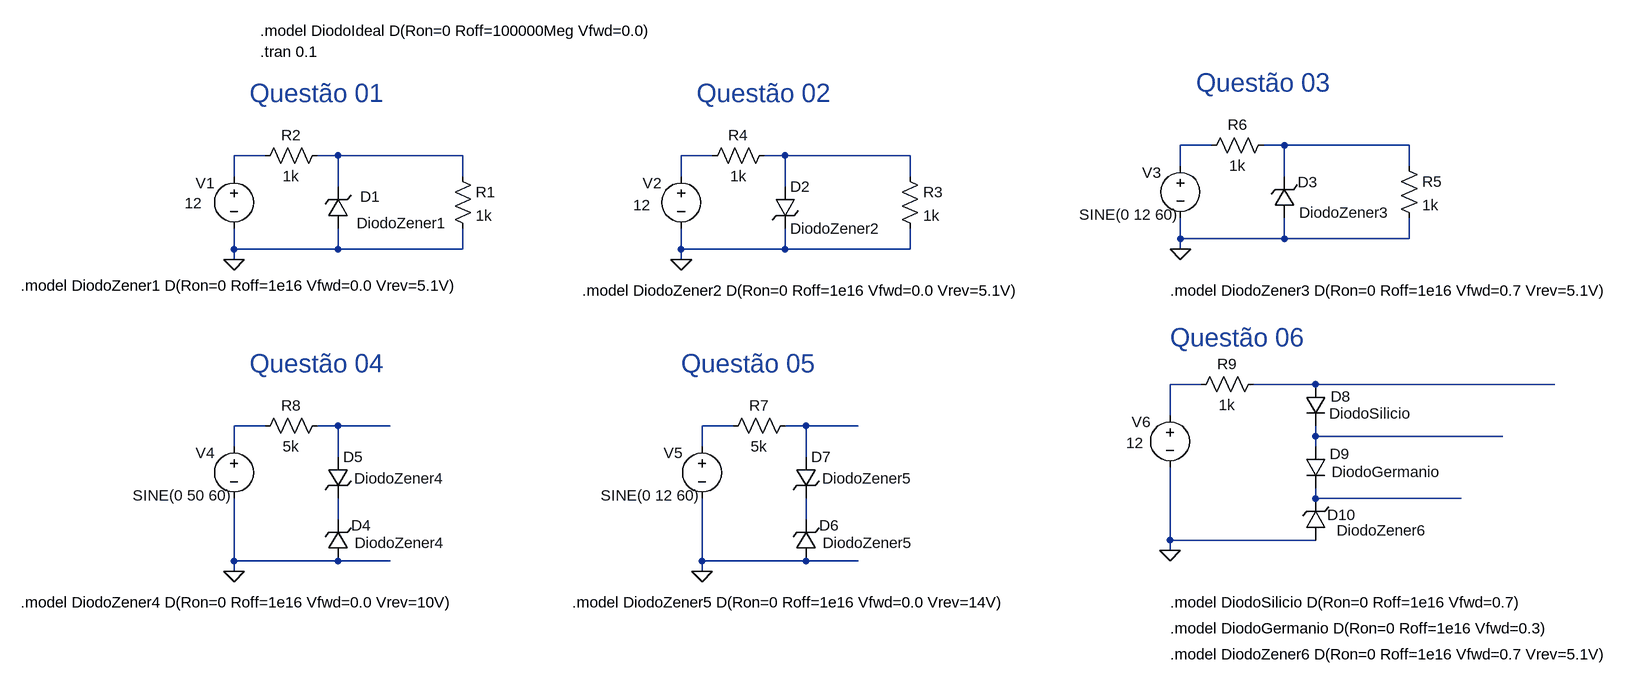
[diagram p0: schematic P1A09-Circuitos2-LTSpice.asc]
P1A09-Circuitos2-LTSpice.asc, the LTspice schematic file:
Version 4
SHEET 1 2300 1300
WIRE 1424 0 1376 0
WIRE 1536 0 1504 0
WIRE 1728 0 1536 0
WIRE -32 16 -80 16
WIRE 80 16 48 16
WIRE 272 16 80 16
WIRE 656 16 608 16
WIRE 768 16 736 16
WIRE 960 16 768 16
WIRE 1376 32 1376 0
WIRE 1728 32 1728 0
WIRE -80 48 -80 16
WIRE 272 48 272 16
WIRE 608 48 608 16
WIRE 960 48 960 16
WIRE 1536 48 1536 0
WIRE 80 64 80 16
WIRE 768 64 768 16
WIRE 1376 144 1376 112
WIRE 1536 144 1536 112
WIRE 1536 144 1376 144
WIRE 1728 144 1728 112
WIRE 1728 144 1536 144
WIRE -80 160 -80 128
WIRE 80 160 80 128
WIRE 80 160 -80 160
WIRE 272 160 272 128
WIRE 272 160 80 160
WIRE 608 160 608 128
WIRE 768 160 768 128
WIRE 768 160 608 160
WIRE 960 160 960 128
WIRE 960 160 768 160
WIRE 1376 160 1376 144
WIRE -80 176 -80 160
WIRE 608 176 608 160
WIRE 1408 368 1360 368
WIRE 1584 368 1488 368
WIRE 1952 368 1584 368
WIRE 1360 416 1360 368
WIRE -32 432 -80 432
WIRE 80 432 48 432
WIRE 160 432 80 432
WIRE 688 432 640 432
WIRE 800 432 768 432
WIRE 880 432 800 432
WIRE 1584 448 1584 432
WIRE 1872 448 1584 448
WIRE -80 464 -80 432
WIRE 640 464 640 432
WIRE 1584 464 1584 448
WIRE 80 480 80 432
WIRE 800 480 800 432
WIRE 1584 544 1584 528
WIRE 1808 544 1584 544
WIRE 80 576 80 544
WIRE 800 576 800 544
WIRE 1360 608 1360 496
WIRE 1584 608 1360 608
WIRE 1360 624 1360 608
WIRE -80 640 -80 544
WIRE 80 640 -80 640
WIRE 160 640 80 640
WIRE 640 640 640 544
WIRE 800 640 640 640
WIRE 880 640 800 640
WIRE -80 656 -80 640
WIRE 640 656 640 640
FLAG -80 176 0
FLAG 608 176 0
FLAG 1376 160 0
FLAG -80 656 0
FLAG 640 656 0
FLAG 1360 624 0
SYMBOL voltage -80 32 R0
WINDOW 123 0 0 Left 2
WINDOW 39 0 0 Left 2
WINDOW 0 -59 26 Left 2
WINDOW 3 -76 57 Left 2
SYMATTR InstName V1
SYMATTR Value 12
SYMBOL res 256 32 R0
SYMATTR InstName R1
SYMATTR Value 1k
SYMBOL res -48 32 R270
WINDOW 0 32 56 VTop 2
WINDOW 3 0 56 VBottom 2
SYMATTR InstName R2
SYMATTR Value 1k
SYMBOL zener 96 128 R180
WINDOW 0 -49 49 Left 2
WINDOW 3 -153 8 Left 2
SYMATTR InstName D1
SYMATTR Value DiodoZener1
SYMBOL voltage 608 32 R0
WINDOW 123 0 0 Left 2
WINDOW 39 0 0 Left 2
WINDOW 0 -59 26 Left 2
WINDOW 3 -74 60 Left 2
SYMATTR InstName V2
SYMATTR Value 12
SYMBOL res 944 32 R0
SYMATTR InstName R3
SYMATTR Value 1k
SYMBOL res 640 32 R270
WINDOW 0 32 56 VTop 2
WINDOW 3 0 56 VBottom 2
SYMATTR InstName R4
SYMATTR Value 1k
SYMBOL zener 752 64 R0
SYMATTR InstName D2
SYMATTR Value DiodoZener2
SYMBOL voltage 1376 16 R0
WINDOW 123 0 0 Left 2
WINDOW 39 0 0 Left 2
WINDOW 0 -59 26 Left 2
WINDOW 3 -156 91 Left 2
SYMATTR InstName V3
SYMATTR Value SINE(0 12 60)
SYMBOL res 1712 16 R0
SYMATTR InstName R5
SYMATTR Value 1k
SYMBOL res 1408 16 R270
WINDOW 0 32 56 VTop 2
WINDOW 3 0 56 VBottom 2
SYMATTR InstName R6
SYMATTR Value 1k
SYMBOL zener 1552 112 R180
WINDOW 0 -35 55 Left 2
WINDOW 3 -147 8 Left 2
SYMATTR InstName D3
SYMATTR Value DiodoZener3
SYMBOL voltage -80 448 R0
WINDOW 123 0 0 Left 2
WINDOW 39 0 0 Left 2
WINDOW 0 -59 26 Left 2
WINDOW 3 -156 91 Left 2
SYMATTR InstName V4
SYMATTR Value SINE(0 50 60)
SYMBOL res -48 448 R270
WINDOW 0 32 56 VTop 2
WINDOW 3 0 56 VBottom 2
SYMATTR InstName R8
SYMATTR Value 5k
SYMBOL zener 96 640 R180
WINDOW 0 -35 55 Left 2
WINDOW 3 -150 28 Left 2
SYMATTR InstName D4
SYMATTR Value DiodoZener4
SYMBOL zener 64 480 R0
WINDOW 3 41 33 Left 2
SYMATTR Value DiodoZener4
SYMATTR InstName D5
SYMBOL voltage 640 448 R0
WINDOW 123 0 0 Left 2
WINDOW 39 0 0 Left 2
WINDOW 0 -59 26 Left 2
WINDOW 3 -156 91 Left 2
SYMATTR InstName V5
SYMATTR Value SINE(0 12 60)
SYMBOL res 672 448 R270
WINDOW 0 32 56 VTop 2
WINDOW 3 0 56 VBottom 2
SYMATTR InstName R7
SYMATTR Value 5k
SYMBOL zener 816 640 R180
WINDOW 0 -35 55 Left 2
WINDOW 3 -150 28 Left 2
SYMATTR InstName D6
SYMATTR Value DiodoZener5
SYMBOL zener 784 480 R0
WINDOW 3 41 33 Left 2
SYMATTR Value DiodoZener5
SYMATTR InstName D7
SYMBOL voltage 1360 400 R0
WINDOW 123 0 0 Left 2
WINDOW 39 0 0 Left 2
WINDOW 0 -59 26 Left 2
WINDOW 3 -67 58 Left 2
SYMATTR InstName V6
SYMATTR Value 12
SYMBOL res 1392 384 R270
WINDOW 0 32 56 VTop 2
WINDOW 3 0 56 VBottom 2
SYMATTR InstName R9
SYMATTR Value 1k
SYMBOL zener 1600 608 R180
WINDOW 0 -46 39 Left 2
WINDOW 3 -157 15 Left 2
SYMATTR InstName D10
SYMATTR Value DiodoZener6
SYMBOL diode 1568 368 R0
WINDOW 0 39 19 Left 2
WINDOW 3 37 45 Left 2
SYMATTR InstName D8
SYMATTR Value DiodoSilicio
SYMBOL diode 1568 464 R0
WINDOW 0 38 11 Left 2
WINDOW 3 41 39 Left 2
SYMATTR InstName D9
SYMATTR Value DiodoGermanio
TEXT -40 -144 Left 2 !.tran 0.1
TEXT -40 -176 Left 2 !.model DiodoIdeal D(Ron=0 Roff=100000Meg Vfwd=0.0)
TEXT 1360 704 Left 2 !.model DiodoSilicio D(Ron=0 Roff=1e16 Vfwd=0.7)
TEXT -56 -80 Left 4 ;Questão 01
TEXT -408 216 Left 2 !.model DiodoZener1 D(Ron=0 Roff=1e16 Vfwd=0.0 Vrev=5.1V)
TEXT 1360 744 Left 2 !.model DiodoGermanio D(Ron=0 Roff=1e16 Vfwd=0.3)
TEXT 1360 224 Left 2 !.model DiodoZener3 D(Ron=0 Roff=1e16 Vfwd=0.7 Vrev=5.1V)
TEXT 632 -80 Left 4 ;Questão 02
TEXT 1400 -96 Left 4 ;Questão 03
TEXT -56 336 Left 4 ;Questão 04
TEXT -408 704 Left 2 !.model DiodoZener4 D(Ron=0 Roff=1e16 Vfwd=0.0 Vrev=10V)
TEXT 608 336 Left 4 ;Questão 05
TEXT 440 704 Left 2 !.model DiodoZener5 D(Ron=0 Roff=1e16 Vfwd=0.0 Vrev=14V)
TEXT 1360 784 Left 2 !.model DiodoZener6 D(Ron=0 Roff=1e16 Vfwd=0.7 Vrev=5.1V)
TEXT 456 224 Left 2 !.model DiodoZener2 D(Ron=0 Roff=1e16 Vfwd=0.0 Vrev=5.1V)
TEXT 1360 296 Left 4 ;Questão 06

The netlist it stands for:
* P1A09-Circuitos2-LTSpice.asc
V1 N003 0 12
R1 N004 0 1k
R2 N003 N004 1k
D1 0 N004 DiodoZener1
V2 N005 0 12
R3 N006 0 1k
R4 N005 N006 1k
D2 N006 0 DiodoZener2
V3 N001 0 SINE(0 12 60)
R5 N002 0 1k
R6 N001 N002 1k
D3 0 N002 DiodoZener3
V4 N009 0 SINE(0 50 60)
R8 N009 N010 5k
D4 0 N015 DiodoZener4
D5 N010 N015 DiodoZener4
V5 N011 0 SINE(0 12 60)
R7 N011 N012 5k
D6 0 N016 DiodoZener5
D7 N012 N016 DiodoZener5
V6 N007 0 12
R9 N007 N008 1k
D10 0 N014 DiodoZener6
D8 N008 N013 DiodoSilicio
D9 N013 N014 DiodoGermanio
.model D D
.lib standard.dio
.tran 0.1
.model DiodoIdeal D(Ron=0 Roff=100000Meg Vfwd=0.0)
.model DiodoSilicio D(Ron=0 Roff=1e16 Vfwd=0.7)
* Questão 01
.model DiodoZener1 D(Ron=0 Roff=1e16 Vfwd=0.0 Vrev=5.1V)
.model DiodoGermanio D(Ron=0 Roff=1e16 Vfwd=0.3)
.model DiodoZener3 D(Ron=0 Roff=1e16 Vfwd=0.7 Vrev=5.1V)
* Questão 02
* Questão 03
* Questão 04
.model DiodoZener4 D(Ron=0 Roff=1e16 Vfwd=0.0 Vrev=10V)
* Questão 05
.model DiodoZener5 D(Ron=0 Roff=1e16 Vfwd=0.0 Vrev=14V)
.model DiodoZener6 D(Ron=0 Roff=1e16 Vfwd=0.7 Vrev=5.1V)
.model DiodoZener2 D(Ron=0 Roff=1e16 Vfwd=0.0 Vrev=5.1V)
* Questão 06
.backanno
.end